# EAGLE schematic cnc_driver_3 (EAGLE 7.6.0)
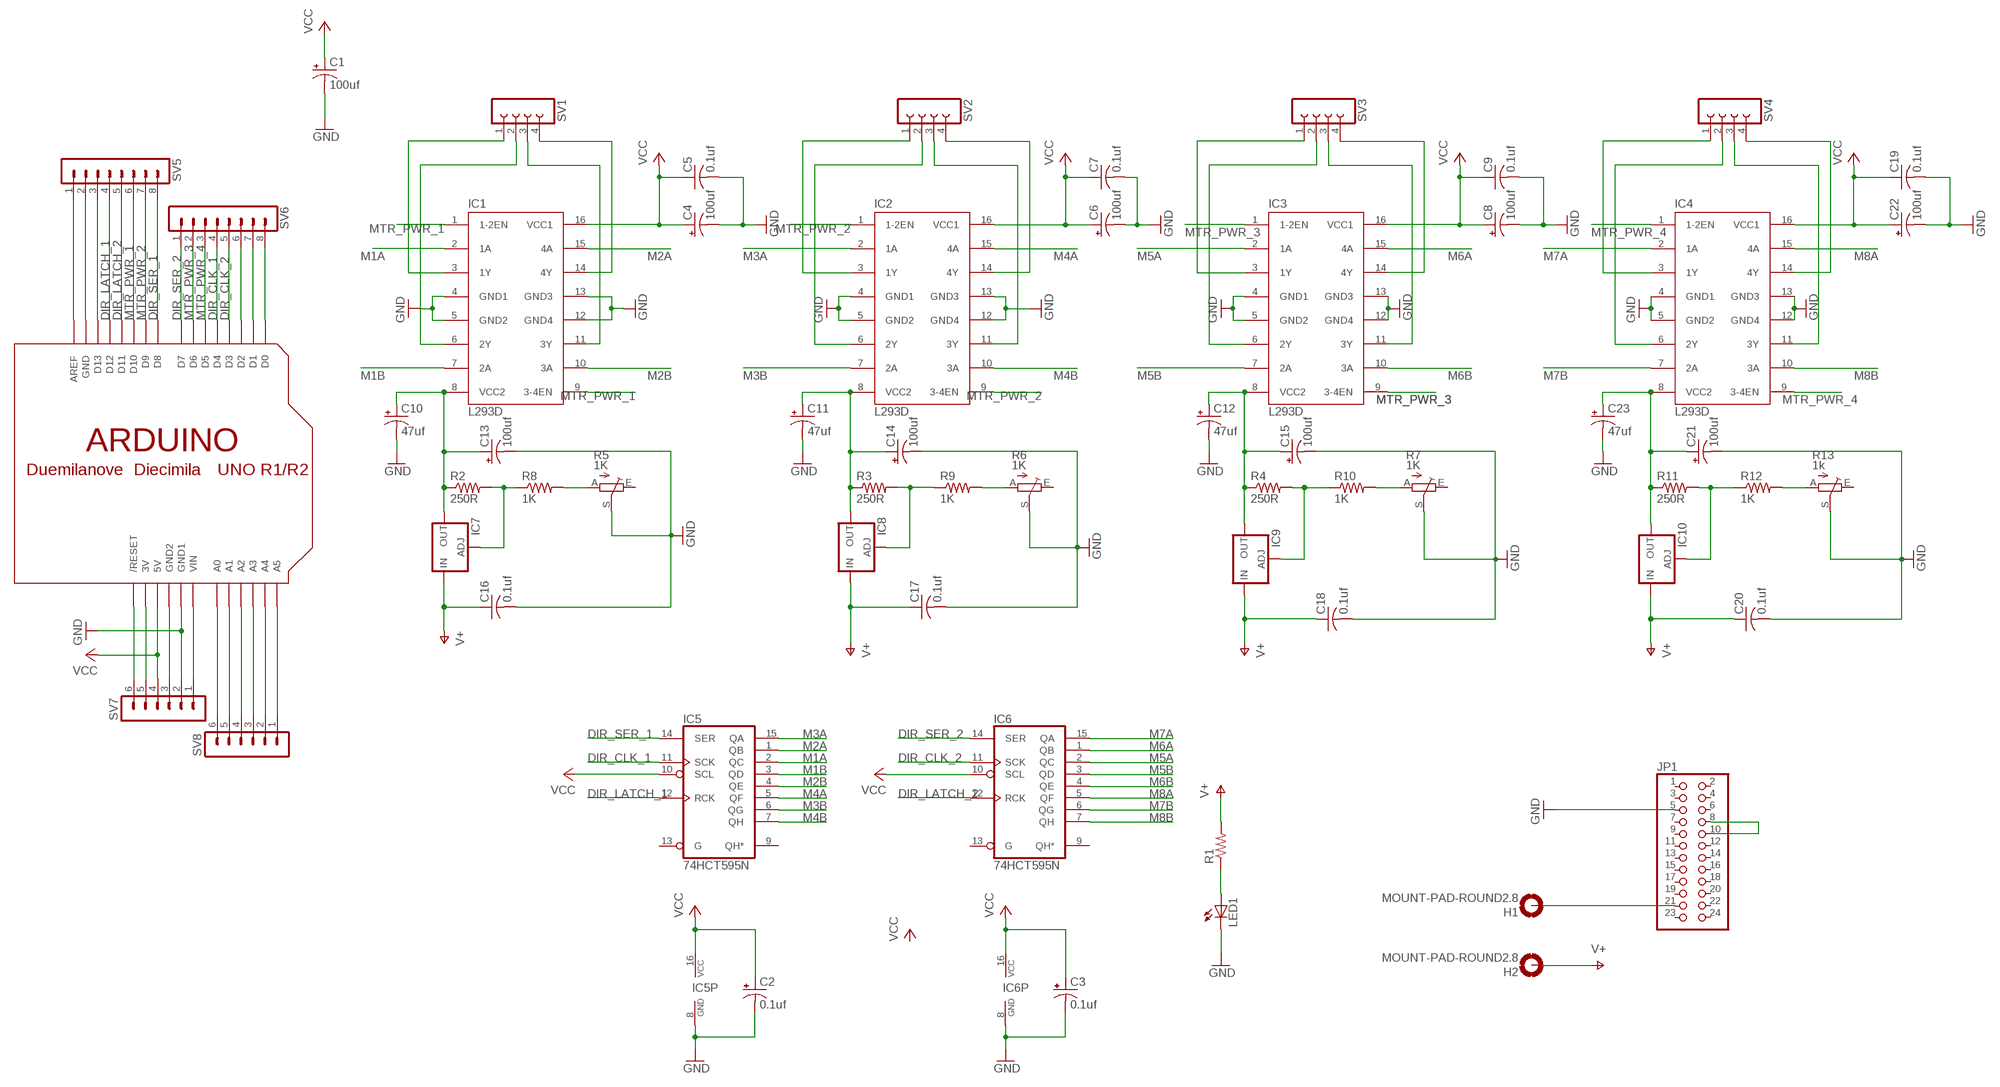
[diagram p0: schematic, sheet 1]

## Parts
C1  100uf  CPOL-USE2-5  [E2-5]
C2  0.1uf  CPOL-USE2-5  [E2-5]
C3  0.1uf  CPOL-USE2-5  [E2-5]
C4  100uf  CPOL-USE2-5  [E2-5]
C5  0.1uf  C-US025-025X050  [C025-025X050]
C6  100uf  CPOL-USE2-5  [E2-5]
C7  0.1uf  C-US025-025X050  [C025-025X050]
C8  100uf  CPOL-USE2-5  [E2-5]
C9  0.1uf  C-US025-025X050  [C025-025X050]
C10  47uf  CPOL-USE2-5  [E2-5]
C11  47uf  CPOL-USE2-5  [E2-5]
C12  47uf  CPOL-USE2-5  [E2-5]
C13  100uf  CPOL-USE3.5-8  [E3,5-8]
C14  100uf  CPOL-USE3.5-8  [E3,5-8]
C15  100uf  CPOL-USE3.5-8  [E3,5-8]
C16  0.1uf  C-US025-024X044  [C025-024X044]
C17  0.1uf  C-US025-024X044  [C025-024X044]
C18  0.1uf  C-US025-024X044  [C025-024X044]
C19  0.1uf  C-US025-025X050  [C025-025X050]
C20  0.1uf  C-US025-025X050  [C025-025X050]
C21  100uf  CPOL-USE3.5-8  [E3,5-8]
C22  100uf  CPOL-USE3.5-8  [E3,5-8]
C23  47uf  CPOL-USE3.5-8  [E3,5-8]
H1  MOUNT-PAD-ROUND2.8  [2,8-PAD]
H2  MOUNT-PAD-ROUND2.8  [2,8-PAD]
IC1  L293D  [DIL16]
IC2  L293D  [DIL16]
IC3  L293D  [DIL16]
IC4  L293D  [DIL16]
IC5  74HCT595N  [DIL16]
IC6  74HCT595N  [DIL16]
IC7  LM317TS  [317TS]
IC8  LM317TS  [317TS]
IC9  LM317TS  [317TS]
IC10  LM317TS  [317TS]
JP1  PINHD-2X12  [2X12]
LED1  LED5MM  [LED5MM]
R1  R-US_0204/7  [0204/7]
R2  250R  R-US_0207/7  [0207/7]
R3  250R  R-US_0207/7  [0207/7]
R4  250R  R-US_0207/7  [0207/7]
R5  1K  TRIM_EU-CA9H  [CA9H]
R6  1K  TRIM_EU-CA9H  [CA9H]
R7  1K  TRIM_EU-CA9H  [CA9H]
R8  1K  R-US_0207/7  [0207/7]
R9  1K  R-US_0207/7  [0207/7]
R10  1K  R-US_0207/7  [0207/7]
R11  250R  R-US_0207/7  [0207/7]
R12  1K  R-US_0207/7  [0207/7]
R13  1k  TRIM_EU-CA9H  [CA9H]
SV1  FE04-1  [FE04-1]
SV2  FE04-1  [FE04-1]
SV3  FE04-1  [FE04-1]
SV4  FE04-1  [FE04-1]
SV5  MA08-1  [MA08-1]
SV6  MA08-1  [MA08-1]
SV7  MA06-1  [MA06-1]
SV8  MA06-1  [MA06-1]
U$1  ARDUINOUNO  [ARDUINO]

## Nets
DIR_CLK_1: IC5.11(SCK) SV6.4 U$1.D4
DIR_CLK_2: IC6.11(SCK) SV6.5 U$1.D3
DIR_LATCH_1: IC5.12(RCK) SV5.4 U$1.D12
DIR_LATCH_2: IC6.12(RCK) SV5.5 U$1.D11
DIR_SER_1: IC5.14(SER) SV5.8 U$1.D8
DIR_SER_2: IC6.14(SER) SV6.1 U$1.D7
GND: C1.- C2.- C3.- C4.- C5.2 C6.- C7.2 C8.- C9.2 C10.- C11.- C12.- C13.- C14.- C15.- C16.2 C17.2 C18.2 C19.2 C20.2 C21.- C22.- C23.- IC1.4(GND1) IC1.5(GND2) IC1.12(GND4) IC1.13(GND3) IC2.4(GND1) IC2.5(GND2) IC2.12(GND4) IC2.13(GND3) IC3.4(GND1) IC3.5(GND2) IC3.12(GND4) IC3.13(GND3) IC4.4(GND1) IC4.5(GND2) IC4.12(GND4) IC4.13(GND3) IC5.8(GND) IC6.8(GND) JP1.5 LED1.K(C) R5.S R6.S R7.S R13.S SV7.2 U$1.GND1
M1A: IC1.2(1A) IC5.2(QC)
M1B: IC1.7(2A) IC5.3(QD)
M2A: IC1.15(4A) IC5.1(QB)
M2B: IC1.10(3A) IC5.4(QE)
M3A: IC2.2(1A) IC5.15(QA)
M3B: IC2.7(2A) IC5.6(QG)
M4A: IC2.15(4A) IC5.5(QF)
M4B: IC2.10(3A) IC5.7(QH)
M5A: IC3.2(1A) IC6.2(QC)
M5B: IC3.7(2A) IC6.3(QD)
M6A: IC3.15(4A) IC6.1(QB)
M6B: IC3.10(3A) IC6.4(QE)
M7A: IC4.2(1A) IC6.15(QA)
M7B: IC4.7(2A) IC6.6(QG)
M8A: IC4.15(4A) IC6.5(QF)
M8B: IC4.10(3A) IC6.7(QH)
MTR_PWR_1: IC1.1(1-2EN) IC1.9(3-4EN) SV5.6 U$1.D10
MTR_PWR_2: IC2.1(1-2EN) IC2.9(3-4EN) SV5.7 U$1.D9
MTR_PWR_3: IC3.1(1-2EN) IC3.9(3-4EN) SV6.2 U$1.D6
MTR_PWR_4: IC4.1(1-2EN) IC4.9(3-4EN) SV6.3 U$1.D5
N$1: IC1.3(1Y) SV1.1
N$2: IC1.6(2Y) SV1.2
N$3: IC1.11(3Y) SV1.3
N$4: IC1.14(4Y) SV1.4
N$5: LED1.A R1.1
N$6: R6.A R9.2
N$7: C10.+ C13.+ IC1.8(VCC2) IC7.2(OUT) R2.1
N$8: IC2.3(1Y) SV2.1
N$9: IC2.6(2Y) SV2.2
N$10: IC2.11(3Y) SV2.3
N$11: IC2.14(4Y) SV2.4
N$12: IC3.3(1Y) SV3.1
N$13: IC3.6(2Y) SV3.2
N$14: IC3.14(4Y) SV3.4
N$15: IC3.11(3Y) SV3.3
N$16: IC7.1(ADJ) R2.2 R8.1
N$17: R5.A R8.2
N$18: IC8.1(ADJ) R3.2 R9.1
N$19: C11.+ C14.+ IC2.8(VCC2) IC8.2(OUT) R3.1
N$20: IC9.1(ADJ) R4.2 R10.1
N$21: C12.+ C15.+ IC3.8(VCC2) IC9.2(OUT) R4.1
N$22: R7.A R10.2
N$23: C21.+ C23.+ IC4.8(VCC2) IC10.2(OUT) R11.1
N$24: IC10.1(ADJ) R11.2 R12.1
N$25: R12.2 R13.A
N$26: IC4.11(3Y) SV4.3
N$27: IC4.6(2Y) SV4.2
N$28: IC4.3(1Y) SV4.1
N$29: IC4.14(4Y) SV4.4
N$30: JP1.8 JP1.10
N$32: H1.B2,8(MOUNT) JP1.21
N$33: SV7.6 U$1.RESET(/RESET)
N$34: SV5.1 U$1.AREF
N$35: SV5.2 U$1.GND
N$36: SV5.3 U$1.D13
N$37: SV6.6 U$1.D2
N$38: SV6.7 U$1.D1
N$39: SV6.8 U$1.D0
N$40: SV7.5 U$1.3V
N$41: SV7.3 U$1.GND2
N$42: SV7.1 U$1.VIN
N$43: SV8.6 U$1.A0
N$44: SV8.5 U$1.A1
N$45: SV8.4 U$1.A2
N$46: SV8.3 U$1.A3
N$47: SV8.2 U$1.A4
N$48: SV8.1 U$1.A5
V+: C16.1 C17.1 C18.1 C20.1 H2.B2,8(MOUNT) IC7.3(IN) IC8.3(IN) IC9.3(IN) IC10.3(IN) R1.2
VCC: C1.+ C2.+ C3.+ C4.+ C5.1 C6.+ C7.1 C8.+ C9.1 C19.1 C22.+ IC1.16(VCC1) IC2.16(VCC1) IC3.16(VCC1) IC4.16(VCC1) IC5.10(SCL) IC5.16(VCC) IC6.10(SCL) IC6.16(VCC) SV7.4 U$1.5V
Unconnected: IC5.9(QH*) IC5.13(G) IC6.9(QH*) IC6.13(G) JP1.1 JP1.2 JP1.3 JP1.4 JP1.6 JP1.7 JP1.9 JP1.11 JP1.12 JP1.13 JP1.14 JP1.15 JP1.16 JP1.17 JP1.18 JP1.19 JP1.20 JP1.22 JP1.23 JP1.24 R5.E R6.E R7.E R13.E

## Library data of the parts
C1-C4 C6 C8 C10-C15 C21-C23 = adafruit:CPOL-US: POLARIZED CAPACITOR, American symbol
C5 C7 C9 C16-C20 = adafruit:C-US: CAPACITOR, American symbol
H1 H2 = holes:MOUNT-PAD-ROUND: MOUNTING PAD, round
IC1-IC4 = st-microelectronics:L293D: PUSH-PULL 4 CHANNEL DRIVER; MPN: L293D; OC_FARNELL: 9589619; OC_NEWARK: 56P8249
IC5 IC6 = 74xx-eu:74*595: 8-bit SHIFT REGISTER, output latch
IC7-IC10 = v-reg:LM317TS: VOLTAGE REGULATOR
JP1 = pinhead:PINHD-2X12: PIN HEADER
LED1 = adafruit:LED: LED OSRAM: - CHIPLED LG R971, LG N971, LY N971, LG Q971, LY Q971, LO R971, LY R971 LH N974, LH R974 LS Q976, LO Q976, LY Q976 LO Q996 - Hyper CHIPLED LW Q18S LB Q993, LB Q99A, LB R99A - SideLED LS A670, LO A670, LY A670, LG A670, LP A670 LB A673, LV A673, LT A673, LW A673 LH A674 LY A675 LS A676, LA A676, LO A676, LY A676, LW A676 LS A679, LY A679, LG A679 - Hyper Micro SIDELED® LS Y876, LA Y876, LO Y876, LY Y876 LT Y87S - SmartLED LW L88C, LW L88S LB L89C, LB L89S, LG L890 LS L89K, LO L89K, LY L89K LS L896, LA L896, LO L896, LY L896 - TOPLED LS T670, LO T670, LY T670, LG T670, LP T670 LSG T670, LSP T670, LSY T670, LOP T670, LYG T670 LG T671, LOG T671, LSG T671 LB T673, LV T673, LT T673, LW T673 LH T674 LS T676, LA T676, LO T676, LY T676, LB T676, LH T676, LSB T676, LW T676 LB T67C, LV T67C, LT T67C, LS T67K, LO T67K, LY T67K, LW E67C LS E67B, LA E67B, LO E67B, LY E67B, LB E67C, LV E67C, LT E67C LW T67C LS T679, LY T679, LG T679 LS T770, LO T770, LY T770, LG T770, LP T770 LB T773, LV T773, LT T773, LW T773 LH T774 LS E675, LA E675, LY E675, LS T675 LS T776, LA T776, LO T776, LY T776, LB T776 LHGB T686 LT T68C, LB T68C - Hyper Mini TOPLED® LB M676 - Mini TOPLED Santana® LG M470 LS M47K, LO M47K, LY M47K Source: http://www.osram.convergy.de/
R1-R4 R8-R12 = adafruit:R-US_: RESISTOR, American symbol
R5-R7 R13 = pot:TRIM_EU-: POTENTIOMETER
SV1-SV4 = custom_fem_headers_4x1:FE04-1: FEMALE HEADER; OC_FARNELL: unknown; OC_NEWARK: unknown
SV5 SV6 = con-lstb:MA08-1: PIN HEADER; OC_FARNELL: unknown; OC_NEWARK: unknown
SV7 SV8 = con-lstb:MA06-1: PIN HEADER; OC_FARNELL: unknown; OC_NEWARK: unknown
U$1 = adafruit:ARDUINO: Arduino Diecimila/Duemilanove Make a shield with ease, this package has all the named pins as well as the two mounting drill holes and an outline of the USB and DC power connector. The outline is on the DIMENSION layer, so if your board house uses it they will cut the outline to match. http://www.ladyada.net/library/pcb/eaglelibrary.html